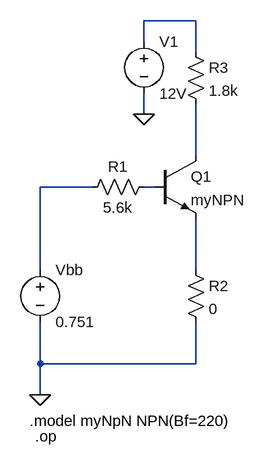
[diagram p0: schematic Draft1.asc]
Draft1.asc, the LTspice schematic file:
Version 4.1
SHEET 1 880 680
WIRE 256 -432 176 -432
WIRE 176 -400 176 -432
WIRE 256 -384 256 -432
WIRE 176 -288 176 -320
WIRE 256 -224 256 -304
WIRE 96 -176 16 -176
WIRE 192 -176 176 -176
WIRE 16 -48 16 -176
WIRE 256 -48 256 -128
WIRE 16 96 16 32
WIRE 256 96 256 32
WIRE 256 96 16 96
WIRE 16 144 16 96
FLAG 16 144 0
FLAG 176 -288 0
SYMBOL voltage 16 -64 R0
SYMATTR InstName Vbb
SYMATTR Value 0.751
SYMBOL res 192 -192 R90
WINDOW 0 0 56 VBottom 2
WINDOW 3 32 56 VTop 2
SYMATTR InstName R1
SYMATTR Value 5.6k
SYMBOL npn 192 -224 R0
SYMATTR InstName Q1
SYMATTR Value myNPN
SYMBOL res 240 -64 R0
SYMATTR InstName R2
SYMATTR Value 0
SYMBOL res 240 -400 R0
SYMATTR InstName R3
SYMATTR Value 1.8k
SYMBOL voltage 176 -416 R0
SYMATTR InstName V1
SYMATTR Value 12V
TEXT 0 184 Left 2 !.model myNpN NPN(Bf=220)
TEXT 8 208 Left 2 !.op

The netlist it stands for:
* Draft1.asc
Vbb N003 0 0.751
R1 N004 N003 5.6k
Q1 N002 N004 N005 0 myNPN
R2 N005 0 0
R3 N001 N002 1.8k
V1 N001 0 12V
.model NPN NPN
.model PNP PNP
.lib standard.bjt
.model myNpN NPN(Bf=220)
.op
.backanno
.end